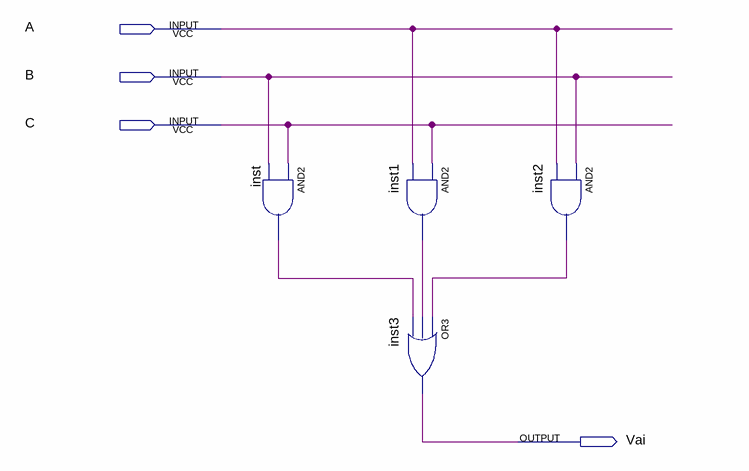
[diagram p0: schematic sheet]
// Quartus schematic Circuito_Vai.bdf as structural Verilog: 4 symbols, 4 pins
module Circuito_Vai (
  input  A,
  input  B,
  input  C,
  output Vai
);

  wire inst1_out, inst2_out, inst_out;

  and inst (inst_out, C, B);
  and inst1 (inst1_out, C, A);
  or inst3 (Vai, inst2_out, inst1_out, inst_out);
  and inst2 (inst2_out, B, A);
endmodule
